# Altium schematic sheet Boost.SchDoc
size A4
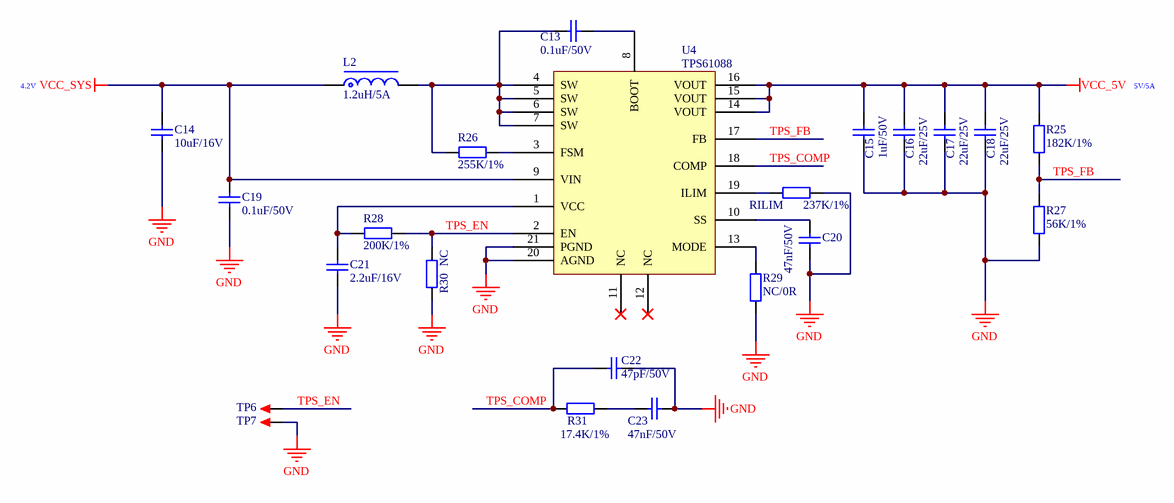
[diagram p0: Boost.SchDoc]

## Parts
C13  0.1uF/50V  [C0402_L]
C14  10uF/16V  [C0805_L]
C15  1uF/50V  [C0603_L]
C16  22uF/25V  [C1206_L]
C17  22uF/25V  [C1206_L]
C18  22uF/25V  [C1206_L]
C19  0.1uF/50V  [C0402_L]
C20  47nF/50V  [C0402_L]
C21  2.2uF/16V  [C0603_L]
C22  47pF/50V  [C0402_L]
C23  47nF/50V  [C0402_L]
L2  1.2uH/5A  [L-SMD-0630]
R25  182K/1%  [R0402_L]
R26  255K/1%  [R0402_L]
R27  56K/1%  [R0402_L]
R28  200K/1%  [R0402_L]
R29  NC/0R  [R0402_L]
R30  NC  [R0402_L]
R31  17.4K/1%  [R0402_L]
RILIM  237K/1%  [R0402_L]
TP6  TEST  [TEST 1]  (value not drawn)
TP7  TEST  [TEST 1]  (value not drawn)
U4  TPS61088  [VQFN-20]

## Nets
GND: C14.1 C15.1 C16.1 C17.1 C18.1 C19.1 C20.1 C21.1 C22.2 C23.2 R27.1 R29.1 R30.1 RILIM.2 TP7.1 U4.20(AGND) U4.21(PGND)
VCC_5V: C15.2 C16.2 C17.2 C18.2 R25.2 U4.14(VOUT) U4.15(VOUT) U4.16(VOUT)
VCC_SYS: C14.2 C19.2 L2.1 U4.9(VIN)
TPS_COMP: C22.1 R31.1 U4.18(COMP)
TPS_EN: R28.2 R30.2 TP6.1 U4.2(EN)
TPS_FB: R25.1 R27.2 U4.17(FB)
NetC13_1: C13.1 L2.2 R26.1 U4.4(SW) U4.5(SW) U4.6(SW) U4.7(SW)
NetC13_2: C13.2 U4.8(BOOT)
NetC20_2: C20.2 U4.10(SS)
NetC21_2: C21.2 R28.1 U4.1(VCC)
NetC23_1: C23.1 R31.2
NetR26_2: R26.2 U4.3(FSM)
NetR29_2: R29.2 U4.13(MODE)
NetRILIM_1: RILIM.1 U4.19(ILIM)

Not connected (* = marked no-connect by the designer): U4 11(NC)* 12(NC)*

## Notes on the sheet
- 4.2V
- 5V/5A

## Library data of the parts
C13-C23 = C: 贴片电容; BOM名称: 无极性贴片电容; 联系卖家，免费查找封装: 唯一出售店铺网址https://shop463601444.taobao.com
L2 = L-CDRH: 功率电感; BOM名称: 功率屏蔽电感; 联系卖家，免费查找封装: 唯一出售店铺网址https://shop463601444.taobao.com
R25-R31 RILIM = R: 贴片电阻; 联系卖家，免费查找封装: 唯一出售店铺网址https://shop463601444.taobao.com; BOM名称: 贴片电阻
TP6 TP7 = TEST: 测试点; 联系卖家，免费查找封装: 唯一出售店铺网址https://shop463601444.taobao.com; 封装库来自淘宝卖家ID：黄晶宝石: 其他店铺购入均为盗版假冒封装库，请立即申请退款; BOM名称: 测试点
U4 = TPS61088: 10A 全集成同步升压转换器